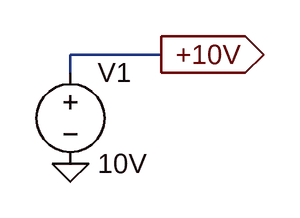
[diagram p0: schematic +10V.asc]
+10V.asc, the LTspice schematic file:
Version 4
SHEET 1 880 680
WIRE 272 112 192 112
WIRE 192 128 192 112
FLAG 192 208 0
FLAG 272 112 +10V
IOPIN 272 112 Out
SYMBOL voltage 192 112 R0
WINDOW 123 0 0 Left 2
WINDOW 39 0 0 Left 2
SYMATTR InstName V1
SYMATTR Value 10V

The netlist it stands for:
* +10V.asc
V1 +10V 0 10V
.backanno
.end